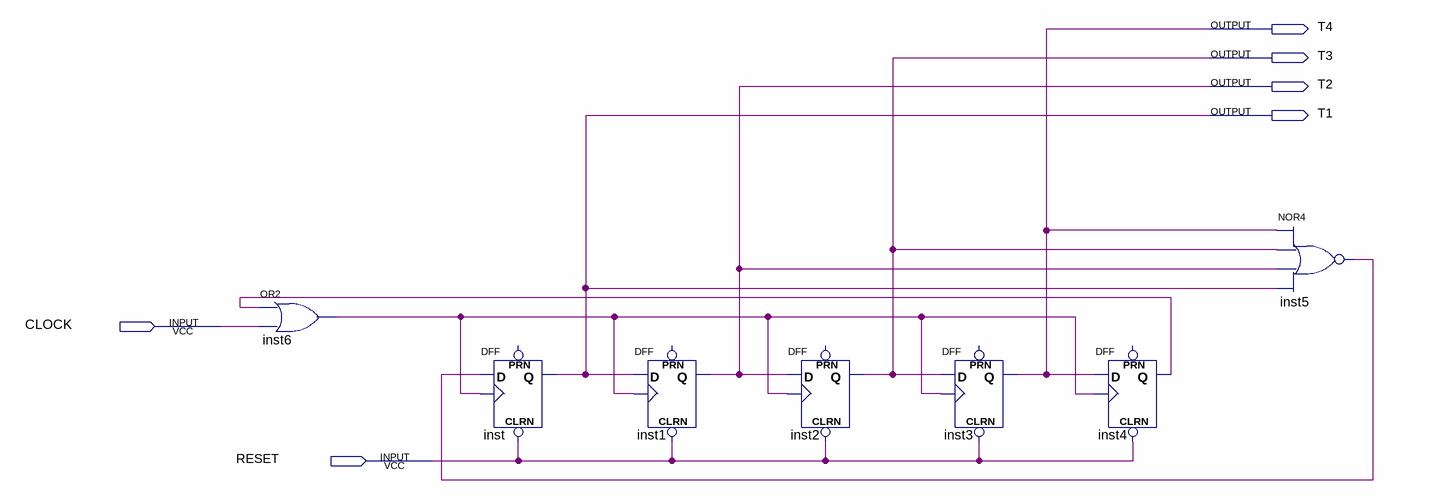
[diagram p0: schematic sheet]
// Quartus schematic SIGNAL.bdf as structural Verilog: 7 symbols, 6 pins
module SIGNAL (
  input  CLOCK,
  input  RESET,
  output T4,
  output T3,
  output T2,
  output T1
);

  wire inst4_q, inst5_out, inst6_out;

  or inst6 (inst6_out, inst4_q, CLOCK);
  DFF inst (.CLRN(RESET), .CLK(inst6_out), .D(inst5_out), .Q(T1));  // open: PRN
  DFF inst1 (.CLRN(RESET), .CLK(inst6_out), .D(T1), .Q(T2));  // open: PRN
  DFF inst2 (.CLRN(RESET), .CLK(inst6_out), .D(T2), .Q(T3));  // open: PRN
  DFF inst3 (.CLRN(RESET), .CLK(inst6_out), .D(T3), .Q(T4));  // open: PRN
  DFF inst4 (.CLRN(RESET), .CLK(inst6_out), .D(T4), .Q(inst4_q));  // open: PRN
  nor inst5 (inst5_out, T4, T3, T2, T1);
endmodule
